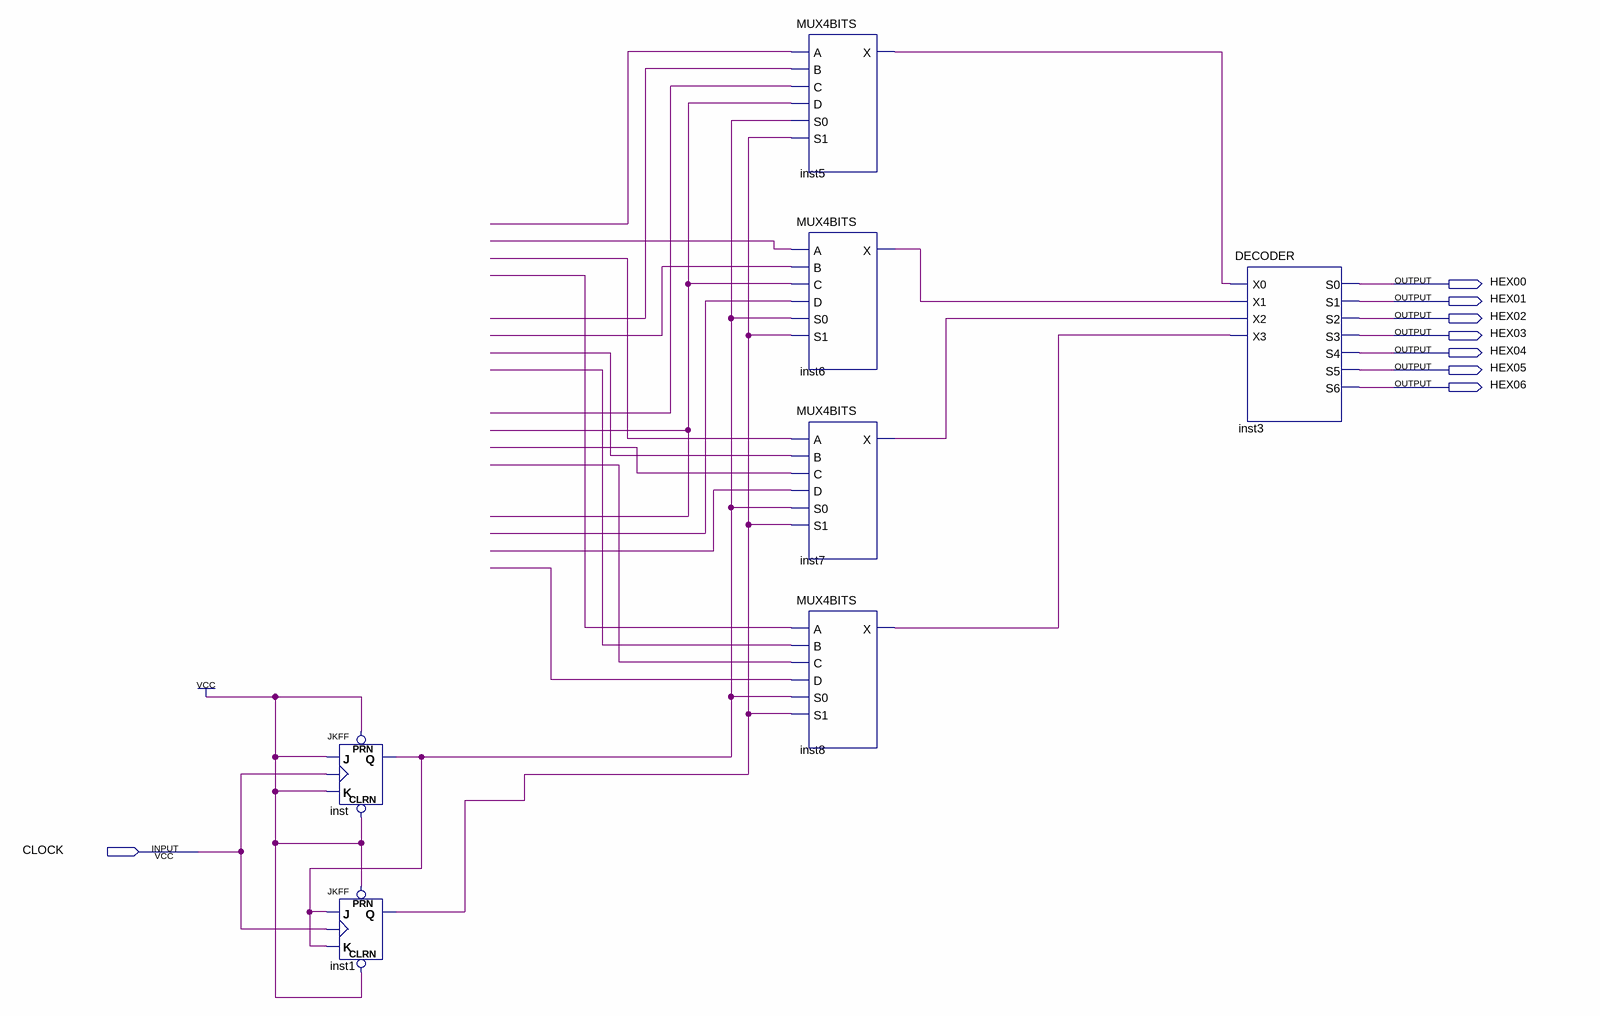
[diagram p0: schematic sheet]
// Quartus schematic BLOCO8PURODIAGRAMA.bdf as structural Verilog: 7 symbols, 8 pins
module BLOCO8PURODIAGRAMA (
  input  CLOCK,
  output HEX00,
  output HEX01,
  output HEX02,
  output HEX03,
  output HEX04,
  output HEX05,
  output HEX06
);

  wire inst1_q, inst5_x, inst6_x, inst7_x, inst8_x, inst_q, undriven, undriven_2, undriven_3, undriven_4,
       undriven_5, undriven_6, undriven_7, undriven_8, undriven_9, undriven_10, undriven_11, undriven_12,
       undriven_13, undriven_14, undriven_15;

  JKFF inst (.PRN(1'b1), .CLRN(1'b1), .K(1'b1), .J(1'b1), .CLK(CLOCK), .Q(inst_q));
  JKFF inst1 (.PRN(1'b1), .CLRN(1'b1), .K(inst_q), .J(inst_q), .CLK(CLOCK), .Q(inst1_q));
  MUX4BITS inst5 (
    .A(undriven), .B(undriven_5), .C(undriven_9), .D(undriven_15), .S0(inst_q), .S1(inst1_q), .X(inst5_x));
  MUX4BITS inst6 (
    .A(undriven_2), .B(undriven_6), .C(undriven_15), .D(undriven_12), .S0(inst_q), .S1(inst1_q), .X(inst6_x));
  MUX4BITS inst7 (
    .A(undriven_3), .B(undriven_7), .C(undriven_10), .D(undriven_13), .S0(inst_q), .S1(inst1_q), .X(inst7_x));
  MUX4BITS inst8 (
    .A(undriven_4), .B(undriven_8), .C(undriven_11), .D(undriven_14), .S0(inst_q), .S1(inst1_q), .X(inst8_x));
  DECODER inst3 (
    .X0(inst5_x), .X1(inst6_x), .X2(inst7_x), .X3(inst8_x), .S0(HEX00), .S1(HEX01), .S2(HEX02), .S3(HEX03),
    .S4(HEX04), .S5(HEX05), .S6(HEX06));
endmodule
